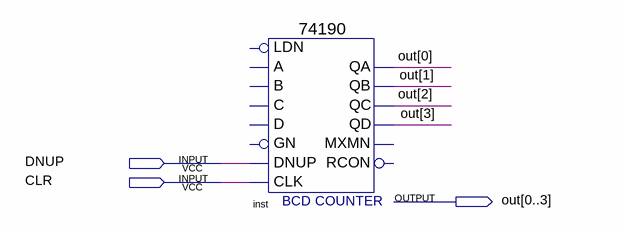
[diagram p0: schematic sheet]
// Quartus schematic GameManager.bdf as structural Verilog: 1 symbols, 3 pins
module GameManager (
  input  DNUP,
  input  CLR,
  output [0:3] out
);

  \74190  inst (
    .CLK(CLR), .DNUP(DNUP), .QA(out[0]), .QB(out[1]), .QD(out[3]), .QC(out[2]));  // open: LDN, A, C, B, D, GN, MXMN, RCON
endmodule
